# Altium schematic sheet Power.SchDoc: Power
size A4; Date: 2022 Fall; Address1: LK Bulls; Address2: Bagoly Zoltan; Address3: Feher Daniel; Address4: G. Varga Gabor; DocumentNumber: 5; Revision: 1.0; SheetNumber: 5; SheetTotal: 14
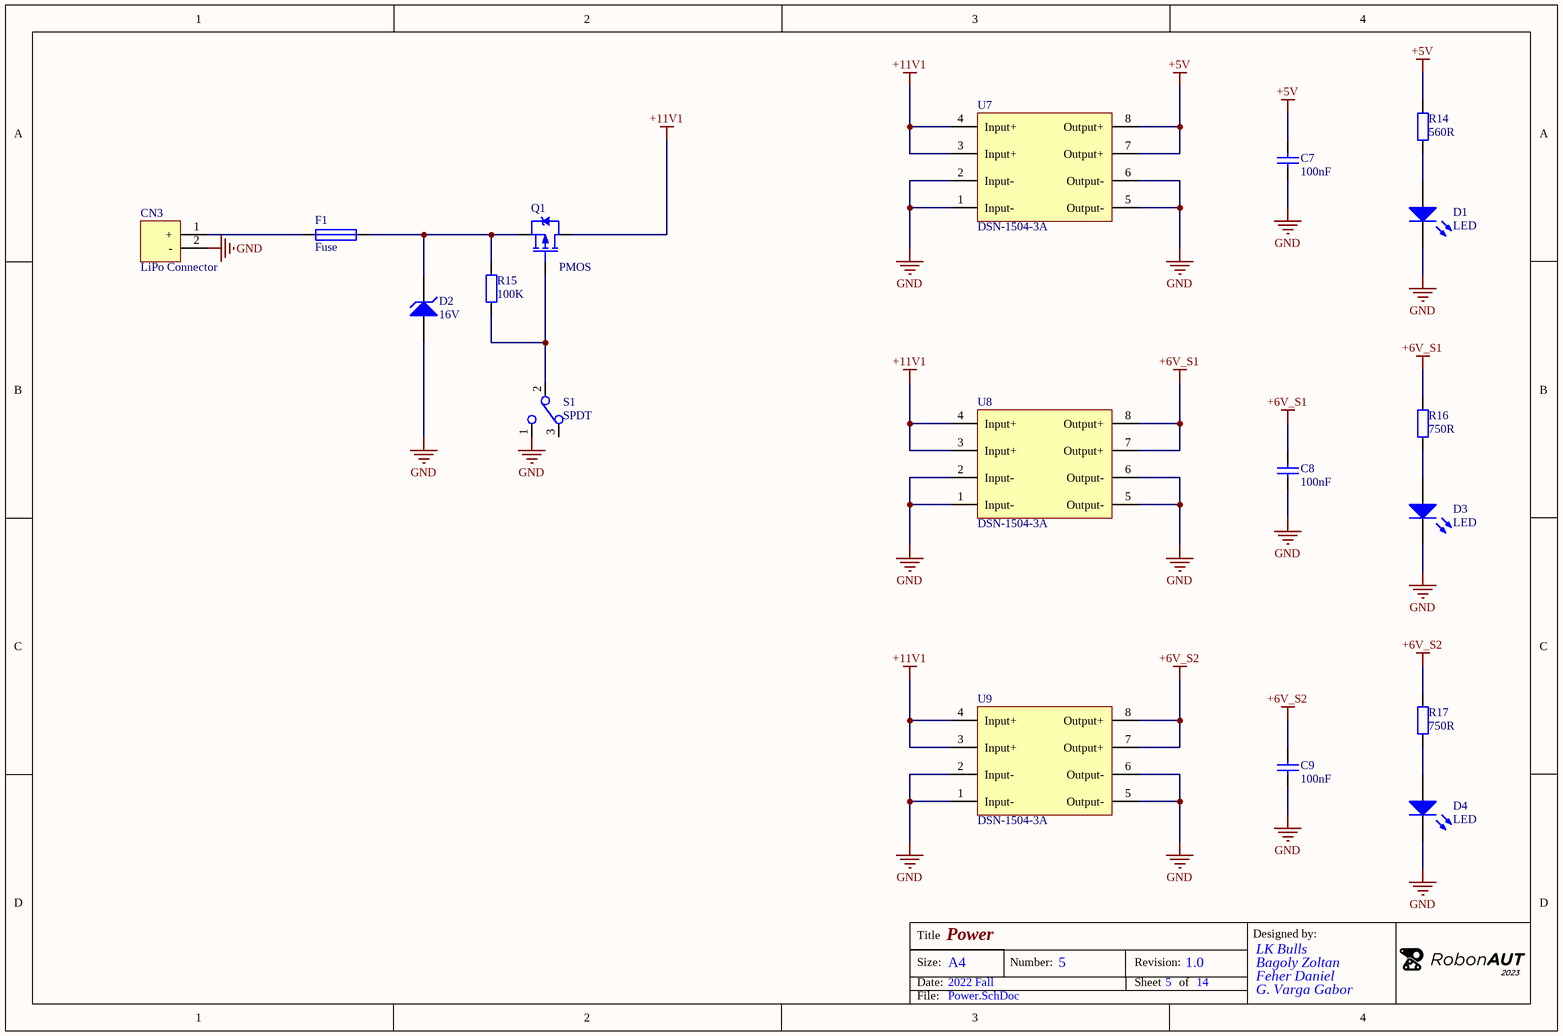
[diagram p0: Power.SchDoc]

## Parts
C7  100nF  [FP_0805_CAP_085]
C8  100nF  [FP_0805_CAP_085]
C9  100nF  [FP_0805_CAP_085]
CN3  LiPo Connector  [FP_BATTERY]
D1  LED  [FP_0805_LED_GREEN]
D2  16V  [FP_SOD-123]
D3  LED  [FP_0805_LED_GREEN]
D4  LED  [FP_0805_LED_GREEN]
F1  Fuse  [FP_CONN2_TUSKE_254MM]
Q1  PMOS  [FP_DPAK-TO252]
R14  560R  [FP_0805_RES]
R15  100K  [FP_0805_RES]
R16  750R  [FP_0805_RES]
R17  750R  [FP_0805_RES]
S1  SPDT  [FP_SPDT]
U7  DSN-1504-3A  [FP_DCDC_DSN]
U8  DSN-1504-3A  [FP_DCDC_DSN]
U9  DSN-1504-3A  [FP_DCDC_DSN]

## Nets
+5V: C7.2 R14.2 U7.7(Output+) U7.8(Output+)
+6V_S1: C8.2 R16.2 U8.7(Output+) U8.8(Output+)
+6V_S2: C9.2 R17.2 U9.7(Output+) U9.8(Output+)
+11V1: Q1.2(D) U7.3(Input+) U7.4(Input+) U8.3(Input+) U8.4(Input+) U9.3(Input+) U9.4(Input+)
GND: C7.1 C8.1 C9.1 CN3.2(-) D1.2(K) D2.A D3.2(K) D4.2(K) S1.1(C1) U7.1(Input-) U7.2(Input-) U7.5(Output-) U7.6(Output-) U8.1(Input-) U8.2(Input-) U8.5(Output-) U8.6(Output-) U9.1(Input-) U9.2(Input-) U9.5(Output-) U9.6(Output-)
NetCN3_1: CN3.1(+) F1.1
NetD1_1: D1.1(A) R14.1
NetD2_K: D2.K F1.2 Q1.3(S) R15.2
NetD3_1: D3.1(A) R16.1
NetD4_1: D4.1(A) R17.1
NetQ1_1: Q1.1(G) R15.1 S1.2(C2)

Not connected (* = marked no-connect by the designer): S1 3(C3)

## Notes on the sheet
- Title
- Size:
- Date:
- A4
- Number:
- Revision:
- Sheet
- of
- Designed by:
- File:

## Library data of the parts
C7-C9 = CAP: Capacitor; Tolerance: 10%; Voltage: 50V; Name: 100nF 0805 10% 50V X7R 0805B104K500NT (FNG); Supplier: Lomex; Reference: 82-13-46; Value: 100nF
CN3 = Connector_LiPo: LiPo Battery Connector; Reference: FD-W115M; Name: XT60 + CAP Apa; Supplier: https://shop.modell.hu/kabel-amass-xt60-cap-apa-csatlakozoval-szerelve
D1 D3 D4 = LED: Typical RED GaAs LED; pin to pad: 1>A 2>K; Name: 2012 GREEN 568nm 70mcd KP-2012MGC (KIN) W.CLEAR 2x1.2x1.1mm 0805 120°; Supplier: Lomex; Reference: 95-00-57
D2 = ZENER: Zener Diode; Name: 16V 0.5W SMSZ1600-35 (MOT) MMSZ5246BT1 SOD-123 ˝J1˝; Supplier: Lomex; U_Z: 16V; Reference: 85-00-88
F1 = Fuse: Name: 6A 30V 30R600UF POLYFUSE 16.5x16.5mm (LFS); Reference: 44-03-11; Supplier: Lomex
Q1 = PMOS: MOSFET, P CH; Name: IRFR9024NTRPBF (INF) P-POWERFET 55V 11A 38W Rds<0.175R DPAK; Supplier: Lomex; Reference: 86-01-67
R14 = RES: Resistor; Tolerance: 5%; Power: 0.125W; Name: 560R 0805 5% CR-05JL7--560R 0.125W (VIK); Supplier: Lomex; Reference: 81-10-84; Value: 560R
R15 = RES: Resistor; Tolerance: 5%; Power: 0.125W; Name: 100K 0805 5% CR-05JL7--100K 0.125W (VIK); Supplier: Lomex; Reference: 81-11-11; Value: 100K
R16 R17 = RES: Resistor; Tolerance: 5%; Power: 0.125W; Name: 750R 0805 5% CR-05JL7--750R 0.125W (VIK); Supplier: Lomex; Reference: 81-12-65; Value: 750R
S1 = SPDT Switch: Single-Pole, Double-Throw Switch; Reference: 100.264.66; Name: TSSM-1022-A2, Kapcsoló, nyelves, 1A/250V AC, M5, SPDT, ON-ON; Supplier: Hestore
U7-U9 = DSN-1504-3A: Switched-Mode Power Supply (SMPS), Step Down (Synchronous Buck) voltage regulator, Input 4.5-28V, Output 0.8-20V, 3A; Reference: 100.381.18; Name: DSN-1504-3A, Kapcsolóüzemű step-down feszültségszabályzó, 4.5-28V/0.8-20V, 3A; Supplier: Hestore